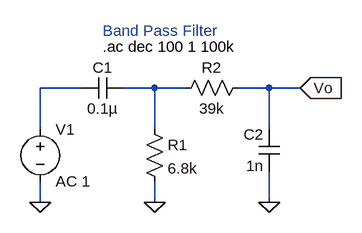
[diagram p0: schematic band_pass_filter.asc]
band_pass_filter.asc, the LTspice schematic file:
Version 4
SHEET 1 880 680
WIRE 96 96 32 96
WIRE 208 96 160 96
WIRE 256 96 208 96
WIRE 384 96 336 96
WIRE 432 96 384 96
WIRE 32 160 32 96
WIRE 208 160 208 96
WIRE 384 160 384 96
WIRE 32 272 32 240
WIRE 208 272 208 240
WIRE 384 272 384 224
FLAG 32 272 0
FLAG 208 272 0
FLAG 384 272 0
FLAG 432 96 Vo
IOPIN 432 96 In
SYMBOL voltage 32 144 R0
WINDOW 123 0 0 Left 0
WINDOW 39 0 0 Left 0
SYMATTR InstName V1
SYMATTR Value AC 1
SYMBOL cap 160 80 R90
WINDOW 0 0 32 VBottom 2
WINDOW 3 32 32 VTop 2
SYMATTR InstName C1
SYMATTR Value 0.1µ
SYMBOL res 192 144 R0
SYMATTR InstName R1
SYMATTR Value 6.8k
SYMBOL res 240 112 R270
WINDOW 0 32 56 VTop 2
WINDOW 3 0 56 VBottom 2
SYMATTR InstName R2
SYMATTR Value 39k
SYMBOL cap 400 224 R180
WINDOW 0 24 56 Left 2
WINDOW 3 24 8 Left 2
SYMATTR InstName C2
SYMATTR Value 1n
TEXT 128 32 Left 2 !.ac dec 100 1 100k
TEXT 128 8 Left 2 ;Band Pass Filter

The netlist it stands for:
* band_pass_filter.asc
V1 N001 0 AC 1
C1 N002 N001 0.1µ
R1 N002 0 6.8k
R2 N002 Vo 39k
C2 0 Vo 1n
.ac dec 100 1 100k
* Band Pass Filter
.backanno
.end